# EAGLE design 304_usb_serial1010 (EAGLE 9.6.0)
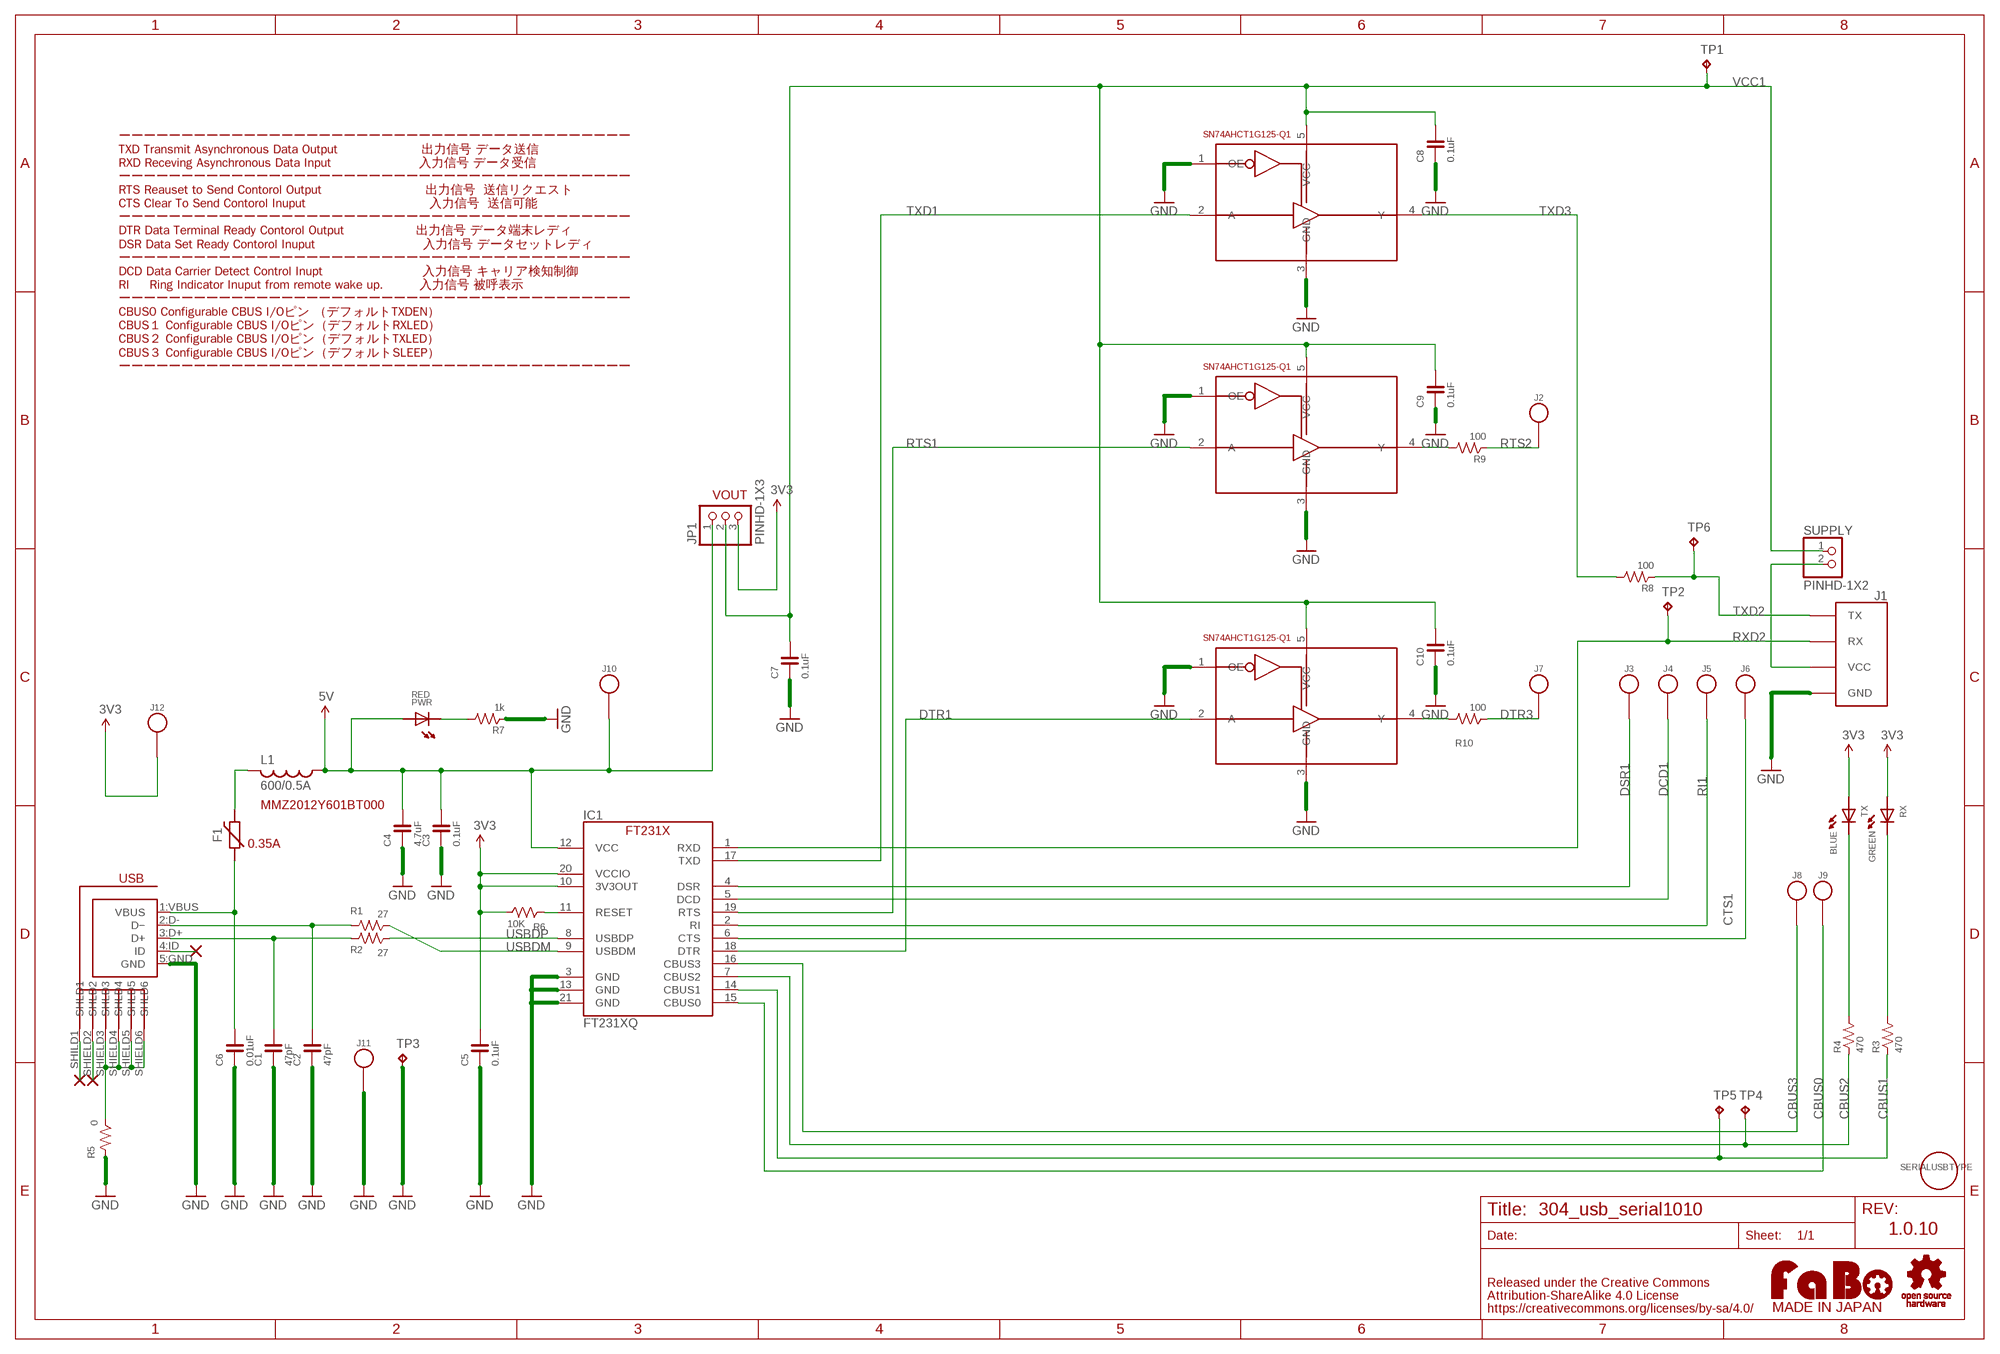
[diagram p0: schematic, sheet 1]

## Parts
C1  47pF  CAPACITOR-0603_NARROW  [0603-NARROW]
C2  47pF  CAPACITOR-0603_NARROW  [0603-NARROW]
C3  0.1uF  CAPACITOR-0603_NARROW  [0603-NARROW]
C4  4.7uF  CAPACITOR-0603_NARROW  [0603-NARROW]
C5  0.1uF  CAPACITOR-0603_NARROW  [0603-NARROW]
C6  0.01uF  CAPACITOR-0603_NARROW  [0603-NARROW]
C7  0.1uF  CAPACITOR-0603_NARROW  [0603-NARROW]
C8  0.1uF  CAPACITOR-0402-NO_SILK  [0402-NO_SILK]
C9  0.1uF  CAPACITOR-0402-NO_SILK  [0402-NO_SILK]
C10  0.1uF  CAPACITOR-0402-NO_SILK  [0402-NO_SILK]
F1  350mA  POLYSWITCH  [NANOSMDC035F]
IC1  FT231XQ  [QFN-20_FT231X]
J1  FABO_SERIAL_DIPINVERSE  [FABO_BRICK_SERIAL_B]
J2  PIN_HEADER_1X1_NOLABEL_C  [PIN_1X1_NOLABEL]
J3  PIN_HEADER_1X1_NOLABEL_C  [PIN_1X1_NOLABEL]
J4  PIN_HEADER_1X1_NOLABEL_C  [PIN_1X1_NOLABEL]
J5  PIN_HEADER_1X1_NOLABEL_C  [PIN_1X1_NOLABEL]
J6  PIN_HEADER_1X1_NOLABEL_C  [PIN_1X1_NOLABEL]
J7  PIN_HEADER_1X1_NOLABEL_C  [PIN_1X1_NOLABEL]
J8  PIN_HEADER_1X1_NOLABEL_C  [PIN_1X1_NOLABEL]
J9  PIN_HEADER_1X1_NOLABEL_C  [PIN_1X1_NOLABEL]
J10  PIN_HEADER_1X1_NOLABEL_C  [PIN_1X1_NOLABEL]
J11  PIN_HEADER_1X1_NOLABEL_C  [PIN_1X1_NOLABEL]
J12  PIN_HEADER_1X1_NOLABEL_C  [PIN_1X1_NOLABEL]
JP1  PINHD-1X3  [1X03]
L1  600/0.5A  INDUCTOR_0805_L  [RESC0805_L]
PWR  RED  LED-0603-NARROW  [0603-NARROW]
R1  27  RESISTOR-0603-NARROW  [0603-NARROW]
R2  27  RESISTOR-0603-NARROW  [0603-NARROW]
R3  470  RESISTOR-0603-NARROW  [0603-NARROW]
R4  470  RESISTOR-0603-NARROW  [0603-NARROW]
R5  0  RESISTOR-0603-NARROW  [0603-NARROW]
R6  10K  RESISTOR-0603-NARROW  [0603-NARROW]
R7  1k  RESISTOR-0603-NARROW  [0603-NARROW]
R8  100  RESISTOR-0603-NARROW  [0603-NARROW]
R9  100  RESISTOR-0603-NARROW  [0603-NARROW]
R10  100  RESISTOR-0603-NARROW  [0603-NARROW]
RX  GREEN  LED-0603-NARROW  [0603-NARROW]
SUPPLY  PINHD-1X2  [1X02]
TP1  TPB1,27  [B1,27]
TP2  TPTP20SQ  [TP20SQ]
TP3  TPTP20SQ  [TP20SQ]
TP4  TPB0,65  [B0,65]
TP5  TPB0,65  [B0,65]
TP6  TPTP20SQ  [TP20SQ]
TX  BLUE  LED-0603-NARROW  [0603-NARROW]
U$2  LOGO_FABO-M_BOTTOM  [LOGO_FABO_MS_BOTTOM]
U$3  LOGO_OSHW-M_BOTTOM  [LOGO_OSHW_M_BOTTOM]
U$4  ZX62D-B-5PA8(30)  [ZX62D-B-5PA8(30)]
U$5  FABO_BRICK_CONLESS_SERIALUSB  [FABO_BRICK_SERIAL_USB_WITHOUTCON]
U$6  SN74AHCT1G125-Q1  [SC70]
U$7  SN74AHCT1G125-Q1  [SC70]
U$8  SN74AHCT1G125-Q1  [SC70]

## Nets
3V3: C5.2 IC1.10(3V3OUT) IC1.20(VCCIO) J12.1 JP1.3 R6.1 RX.ANODE TX.ANODE
5V: C3.2 C4.2 IC1.12(VCC) J10.1 JP1.1 L1.1 PWR.ANODE
CBUS0: IC1.15(CBUS0) J9.1
CBUS1: IC1.14(CBUS1) R3.1 TP5.TP
CBUS2: IC1.7(CBUS2) R4.1 TP4.TP
CBUS3: IC1.16(CBUS3) J8.1
CTS1: IC1.6(CTS) J6.1
DCD1: IC1.5(DCD) J4.1
DSR1: IC1.4(DSR) J3.1
DTR1: IC1.18(DTR) U$8.2(A)
DTR3: J7.1 R10.1
GND: C1.1 C2.1 C3.1 C4.1 C5.1 C6.1 C7.1 C8.1 C9.1 C10.1 IC1.3(GND) IC1.13(GND) IC1.21(GND) J1.GND J11.1 R5.2 R7.1 TP3.TP U$4.5:GND(GND) U$6.1(OE) U$6.3(GND) U$7.1(OE) U$7.3(GND) U$8.1(OE) U$8.3(GND)
N$1: R9.2 U$7.4(Y)
N$2: F1.2 L1.2
N$3: C2.2 R1.2 U$4.2:D-(D−)
N$4: C1.2 R2.2 U$4.3:D+(D+)
N$5: PWR.CATHODE R7.2
N$6: R5.1 U$4.SHIELD3(SHLD3) U$4.SHIELD4(SHLD4) U$4.SHIELD5(SHLD5) U$4.SHIELD6(SHLD6)
N$8: R10.2 U$8.4(Y)
N$15: IC1.11(RESET) R6.2
N$22: U$4.4:ID(ID)
N$24: U$4.SHILD1(SHLD1)
N$28: U$4.SHIELD2(SHLD2)
N$33: R3.2 RX.CATHODE
N$35: R4.2 TX.CATHODE
RI1: IC1.2(RI) J5.1
RTS1: IC1.19(RTS) U$7.2(A)
RTS2: J2.1 R9.1
RXD2: IC1.1(RXD) J1.RX TP2.TP
TXD1: IC1.17(TXD) U$6.2(A)
TXD2: J1.TX R8.1 TP6.TP
TXD3: R8.2 U$6.4(Y)
USBDM: IC1.9(USBDM) R1.1
USBDP: IC1.8(USBDP) R2.1
VBUS: C6.2 F1.1 U$4.1:VBUS(VBUS)
VCC1: C7.2 C8.2 C9.2 C10.2 JP1.2 SUPPLY.1 TP1.TP U$6.5(VCC) U$7.5(VCC) U$8.5(VCC)
VCC2: J1.VCC SUPPLY.2

## Notes on the sheet
- ーーーーーーーーーーーーーーーーーーーーーーーーーーーーーーーーーーーーーーーーー
  TXD Transmit Asynchronous Data Output                     出力信号 データ送信
  RXD Receving Asynchronous Data Input                      入力信号 データ受信
  ーーーーーーーーーーーーーーーーーーーーーーーーーーーーーーーーーーーーーーーーー
  RTS Reauset to Send Contorol Output                          出力信号  送信リクエスト
  CTS Clear To Send Contorol Inuput                               入力信号  送信可能 
  ーーーーーーーーーーーーーーーーーーーーーーーーーーーーーーーーーーーーーーーーー
  DTR Data Terminal Ready Contorol Output                  出力信号 データ端末レディ
  DSR Data Set Ready Contorol Inuput                           入力信号 データセットレディ
  ーーーーーーーーーーーーーーーーーーーーーーーーーーーーーーーーーーーーーーーーー
  DCD Data Carrier Detect Control Inupt                         入力信号 キャリア検知制御
  RI     Ring Indicator Inuput from remote wake up.         入力信号 被呼表示
  ーーーーーーーーーーーーーーーーーーーーーーーーーーーーーーーーーーーーーーーーー
  CBUS0 Configurable CBUS I/Oピン （デフォルトTXDEN）
  CBUS１ Configurable CBUS I/Oピン（デフォルトRXLED）
  CBUS２ Configurable CBUS I/Oピン（デフォルトTXLED）
  CBUS３ Configurable CBUS I/Oピン（デフォルトSLEEP）
  ーーーーーーーーーーーーーーーーーーーーーーーーーーーーーーーーーーーーーーーーー
- VOUT
- MMZ2012Y601BT000
- 0.35A
- 1.0.10

## Library data of the parts
C1-C10 = FaBo-Capacitor:CAPACITOR: CAPACITOR
F1 = FaBo-Parts:POLYSWITCH
IC1 = FaBo-USB:FT231X
J1 = FaBo-Connetor:FABO_SERIAL_DIP: FaBo Brick Serial
J2-J12 = FaBo-PIN:PIN_HEADER_1X1_NOLABEL_C
JP1 = Connector:PINHD-1X3: PIN HEADER; CATEGORY: CONNECTOR; SUB-CATEGORY: PIN-HEADER
L1 = Nordic_nRF:INDUCTOR: Generic chip inductor
PWR RX TX = FaBo-LED:LED
R1-R10 = FaBo-Resistors:RESISTOR: RESISTOR
SUPPLY = Connector:PINHD-1X2: PIN HEADER; CATEGORY: CONNECTOR; SUB-CATEGORY: PIN-HEADER
TP1 = testpad:TP: Test pad
TP2-TP6 = BeagleBone_Blue_R3:TP: Test pad
U$2 = FaBo-Logo:LOGO_FABO
U$3 = FaBo-Logo:LOGO_OSHW
U$4 = FaBo-USB:ZX62D-B-5PA8(30)
U$5 = FaBo-Template:FABO_BRICK_CONLESS_SERIALUSB
U$6-U$8 = FaBo-LevelTranslator:SN74AHCT1G125-Q1: SN74AHCT1G125-Q1 SINGLE BUFFER GATE WITH 3 STATE OUTPUT

## Board
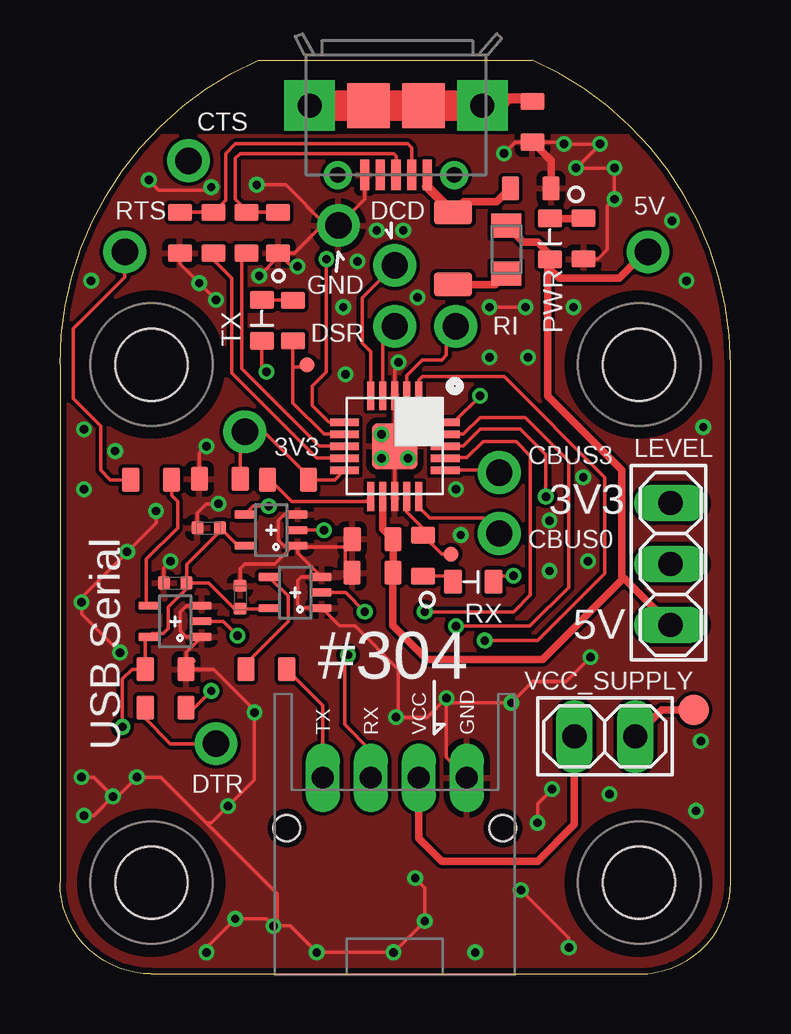
[diagram p1: board, top side]
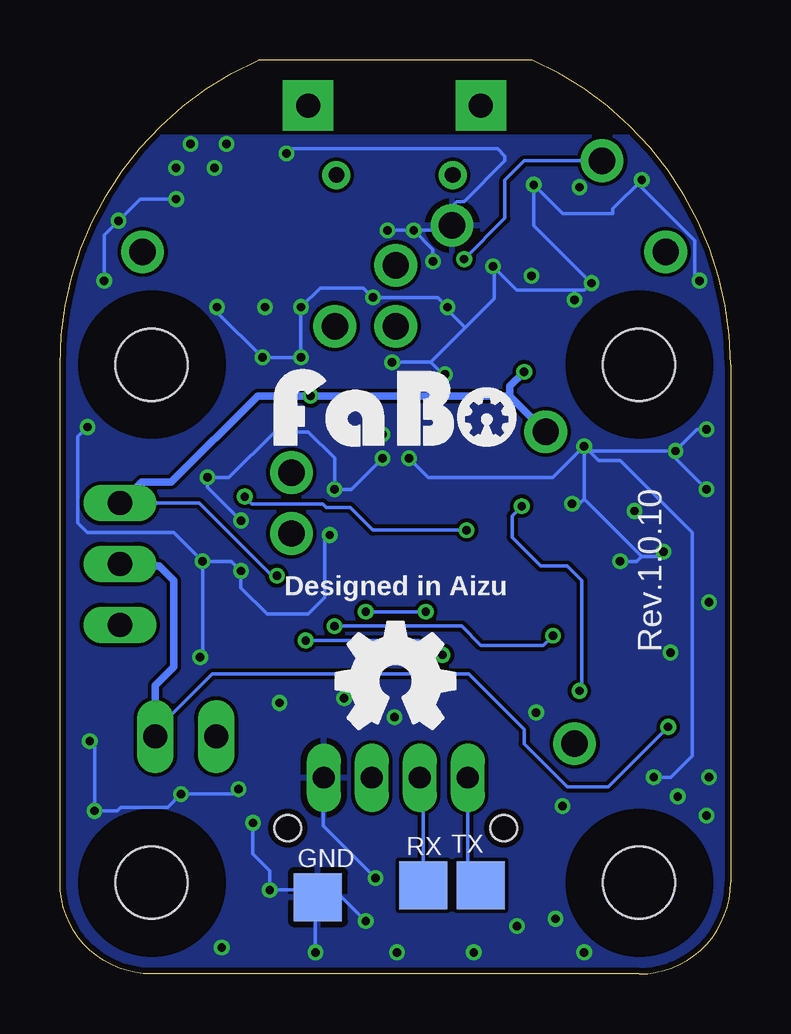
[diagram p2: board, bottom side, seen from below]

Size 27.94 x 38.1 mm. Coordinates in mm from the lower left corner, seen from the top.
Copper layers (1*16): Top 0.035mm / dielectric 1.5mm / Bottom 0.035mm
Design rules "Elecrow_angle": minimum track width 6mil, minimum drill 12mil, track to track 6mil, track to pad 6mil, pad to pad 6mil, via to via 6mil, smd to smd 0mil, copper to edge 10mil, drill to drill 10mil, minimum pad ring 10mil, minimum via ring 6mil, stop-mask expansion 2mil, vias tented up to drill 100mil, thermal gap 10mil
tRestrict: area 0.8,0.8 to 6.8,6.8; area 21.1,0.8 to 27.1,6.8; area 21.1,22.4 to 27.1,28.4; area 0.8,22.4 to 6.8,28.4
bRestrict: area 0.8,22.4 to 6.8,28.4; area 0.8,0.8 to 6.8,6.8; area 21.1,0.8 to 27.1,6.8; area 21.1,22.4 to 27.1,28.4

### Footprints (pad centres in the part's own frame; a part is rotated, then mirrored left to right if it is on the bottom)
0603-NARROW = smd 0.71 x 1: 1 -0.85,0; 2 0.85,0
0402-NO_SILK = smd 0.5 x 0.55: 1 -0.475,0; 2 0.475,0
NANOSMDC035F = smd 1 x 1.6: 1 -1.5,0; 2 1.5,0
QFN-20_FT231X = smd 1.2 x 0.3: 1 -2.1,1; 2 -2.1,0.5; 3 -2.1,0; 4 -2.1,-0.5; 5 -2.1,-1; 11 2.1,-1; 12 2.1,-0.5; 13 2.1,0; 14 2.1,0.5; 15 2.1,1 | smd 0.3 x 1.2: 6 -1,-2.1; 7 -0.5,-2.1; 8 0,-2.1; 9 0.5,-2.1; 10 1,-2.1; 16 1,2.1; 17 0.5,2.1; 18 0,2.1; 19 -0.5,2.1; 20 -1,2.1 | smd 1.9 x 1.9: 21 0,0
FABO_BRICK_SERIAL_B = drill 0.9 pad 1.422 long: GND 3,3.175; RX -1,3.175; TX -3,3.175; VCC 1,3.175 | hole 1.1: -4.5,1.075; 4.5,1.075
PIN_1X1_NOLABEL = drill 1.1 pad 1.778: 1 0,0
1X03 = drill 1.016 long: 1 -2.54,0; 2 0,0; 3 2.54,0
RESC0805_L = smd 1 x 1.25: 1 -1,0; 2 1,0
0603-NARROW' = smd 0.75 x 1: ANODE -0.85,0; CATHODE 0.85,0
1X02 = drill 1.016 long: 1 -1.27,0; 2 1.27,0
B1,27 = smd 1.27 x 1.27: TP 0,0
TP20SQ = smd 2 x 2: TP 0,0
B0,65 = smd 0.635 x 0.635: TP 0,0
ZX62D-B-5PA8(30) = smd 0.4 x 1.25: 1:VBUS -1.3,2.9; 2:D- -0.65,2.9; 3:D+ 0,2.9; 4:ID 0.65,2.9; 5:GND 1.3,2.9 | drill 0.65 pad 1.05: SHIELD2 2.425,2.9; SHILD1 -2.425,2.9 | drill 1 pad 2.1 square: SHIELD3 -3.6,0; SHIELD6 3.6,0 | smd 1.8 x 1.9: SHIELD4 -1.15,0; SHIELD5 1.15,0
FABO_BRICK_SERIAL_USB_WITHOUTCON = hole 3: -10.16,-15.24; 10.16,-15.24; 10.16,6.35; -10.16,6.35
SC70 = smd 0.35 x 0.85: 1 -0.65,-1.1; 2 0,-1.1; 3 0.65,-1.1; 4 0.65,1.1; 5 -0.65,1.1

### Placement (x,y rotation side)
C1  9.09,30.9 90 top
C2  5,30.9 90 top
C3  13.03,18.12 0 top
C4  13.02,16.73 0 top
C5  6.66,20.64 0 top
C6  19.61,32.75 180 top
C7  4.4,12.7 180 top
C8  4.8,16.3 0 top
C9  7.5,15.7 270 top
C10  6.2,18.6 0 top
F1  16.38,30.25 270 top
IC1  13.95,22 270 top
J1  13.95,5 0 top
J2  2.7,30.1 0 top
J3  13.95,27 0 top
J4  13.95,29.54 0 top
J5  16.49,27 0 top
J6  5.35,33.9 0 top
J7  6.5,9.6 0 top
J8  18.3,20.9 0 top
J9  18.3,18.36 0 top
J10  24.5,30.1 0 top
J11  11.6,31.2 0 top
J12  7.7,22.6 0 top
JP1  25.45,17.09 90 top
L1  18.6,30.2 270 top
PWR  RED  [0603-NARROW']  20.41,30.64 90 top
R1  6.4,30.9 90 top
R2  7.77,30.9 90 top
R3  15.12,17.43 270 top
R4  9.71,27.23 90 top
R5  19.68,35.52 270 top
R6  9.5,20.6 180 top
R7  21.82,30.66 90 top
R8  8.6,12.7 180 top
R9  3.8,20.6 0 top
R10  4.4,11.1 0 top
RX  GREEN  [0603-NARROW']  17.22,16.34 180 top
SUPPLY  22.7,9.9 180 top
TP1  26.4,11 0 top
TP2  12.8,3.7 0 bottom
TP3  17.2,3.2 0 bottom
TP4  10.3,25.4 0 top
TP5  16.3,17.5 0 top
TP6  10.4,3.7 0 bottom
TX  BLUE  [0603-NARROW']  8.41,27.25 90 top
U$2  13.97,21.6 0 top
U$3  13.95,12.21 0 top
U$4  14,36.2 180 top
U$5  13.97,19.05 0 top
U$6  9.8,15.9 90 top
U$7  4.8,14.7 90 top
U$8  8.8,18.5 90 top

### Tracks (layer width: path | path; a pad name or v marks a point on that pad's centre or on a via)
3V3  (via drill 0.35)
  Top 0.152: IC1.20 16.4,23 v17.5,24.1 | IC1.10 11.45,20.6 R6.1 10.35,20.75 8.5,22.6 J12.1 7.51,22.41 C5.2 | RX.ANODE 18.32,16.6 v18.9,16.6 | TX.ANODE 8.41,25.29 v8.6,25.1
  Bottom 0.152: v18.9,16.6 19.1,16.6 22.13,19.63 25.4,19.63 JP1.3
  Bottom 0.305: 25.4,19.63 24.53,20.5 23.3,20.5 19.7,24.1 v17.5,24.1 9.2,24.1 | 9.2,24.1 J12.1 | v8.6,25.1 9.2,24.5 9.2,24.1
5V
  Top 0.152: C3.2 13.85,18.15 13.68,18.32 | IC1.12 13.47,19.88 | C4.2 13.9,16.7
  Top 0.305: 23.5,16.5 23.4,16.59 23.4,21 20.32,24.09 20.32,29.48 20.41,29.39 | 23.5,16.5 JP1.1 | PWR.ANODE 20.11,29.8 | IC1.12 13.45,18.55 13.85,18.15 | C3.2 C4.2 13.9,16.7 | C4.2 13.87,14.53 15.28,13.12 20.12,13.12 23.5,16.5 | J10.1 24.5,30.2 23.3,29 20.8,29 20.41,29.39 | 20.41,29.39 PWR.ANODE | L1.1 19.3,30.5 19.9,30.5 20.41,29.98 PWR.ANODE
CBUS0
  Top 0.152: IC1.15 15,19.85 15,19.4 15.4,19 17.66,19 J9.1
CBUS1
  Top 0.152: IC1.14 14.45,19.25 15.12,18.58 R3.1 15.9,17.5 TP5.TP
CBUS2
  Top 0.152: 9.71,26.59 R4.1 9.7,25.3 | IC1.7 11,22.5 9.7,23.8 9.7,25.3 | TP4.TP 10.2,25.3 9.7,25.3
CBUS3
  Top 0.152: IC1.16 18.2,21 J8.1
CTS1  (via drill 0.35)
  Top 0.152: v11.1,29.8 11.1,25.1 10.5,24.5 10.5,23.7 11.2,23 IC1.6
  Bottom 0.152: v11.1,29.8 9.4,31.5 9.4,33.1 8.6,33.9 J6.1
DCD1
  Top 0.152: IC1.5 12.95,25.95 12.6,26.3 12.6,28.2 J4.1
DSR1
  Top 0.152: IC1.4 13.45,26.5 J3.1
DTR1  (via drill 0.35)
  Top 0.152: IC1.18 16.8,22 17.52,22.72 19.18,22.72 20.24,21.66 v20.24,19.9 | U$8.2 v11,18.5
  Bottom 0.152: v20.24,19.9 19.94,19.6 17,19.6 16.85,19.45 15.85,19.45 14.9,18.5 v11,18.5
DTR3
  Top 0.152: R10.1 3.55,10.65 4.6,9.6 J7.1
GND  (via drill 0.35)
  Top 0.152: v18.5,34.2 18.98,34.67 R5.2 19.7,34.67 20.93,34.67 v21,34.6 v22.5,34.6 v21.5,33.6 v23.1,33.6 v23.1,32.3 22.8,32 22.8,30.2 22.4,29.8 22.39,29.8 R7.1 | 4.84,29.75 4.7,29.75 C2.1 5,29.61 v5.8,28.8 v6.5,28.1 | IC1.13 IC1.21 | 11.88,17.8 11.88,18.2 12.18,17.9 C3.1 11.85,17.8 9.9,17.8 | 11.88,17.8 11.88,17.02 C4.1 | C7.1 5,12.95 | 5.6,13.05 C7.1 | 11.89,17 C4.1 | 12.7,32.8 U$4.5:GND 12.7,32.3 J11.1 11.1,31.2 | v8.2,32.9 9.4,32.9 11.1,31.2 | 9.12,30.02 C1.1 9.75,30.05 10.9,31.2 11.1,31.2 | 9.12,30.02 9.64,29.5 v9.9,29.5 | v14.1,25.5 13.95,25.35 IC1.3 IC1.21 | IC1.21 14.45,22.5 v14.5,22.5 | IC1.21 14,22 v14.5,21.5 | IC1.21 13.45,21.5 v13.4,21.5 | v6.1,22 5.81,21.71 C5.1 | 6.1,6.3 9.05,3.35 9.05,2.25 8.85,2.05 | 6.1,6.3 4.2,8.2 v3.2,8.2 2.4,7.4 v2.2,7.4 | IC1.21 13.45,22.5 v13.4,22.5 | 14.6,4 v14.8,4 | v17.9,27.8 v19.4,27.8 | v22.1,13.2 21.1,12.2 19.7,12.2 v18.8,11.3 16.3,11.3 v16.1,11.5 | v16.1,11.5 15.3,10.7 14.1,10.7 | 14.1,10.7 v14,10.7 | J1.GND 16.1,9.03 v16.1,11.5 | v0.9,8.2 1.4,8.2 v2.2,7.4 | v1,6.6 1.4,6.6 v2.2,7.4 | 6.1,6.3 6.3,6.3 v7,7 8.1,8.1 v8.1,10.9 8.1,11 6.4,12.7 C7.1 | v6.1,0.9 6.1,1.1 v7.3,2.3 8.6,2.3 8.85,2.05 | 8.85,2.05 v8.9,2 9.6,2 v10.7,0.9 v13.9,0.9 v15.2,2.2 15.2,3.6 v14.8,4 | 14.7,4.1 v14.8,4 | v19.9,6.3 19.9,7.1 v20.5,7.7 | v19.2,3.5 21.2,1.5 v21.2,1.1 | v6.3,32.8 6.18,32.68 4.12,32.68 v3.7,33.1 | v8.3,29.1 9.12,29.92 9.12,30.02 | 11.99,16.9 C4.1 | 11.7,17.8 11.88,17.8 | 9.7,17.85 U$8.1 9.9,17.8 | 9.7,17.85 9.35,17.85 9.1,18.1 9.1,18.9 9.35,19.15 U$8.3 | U$7.3 5.25,15.35 5,15.1 5,14.3 5.25,14.05 U$7.1 5.25,13.4 C7.1 | C10.1 5.72,19.23 6.1,19.6 v6.6,19.6 | C8.1 4.33,16.93 v4.6,17.2 | 9.9,17.8 9.9,17.55 U$6.3 10.05,16.55 9.9,16.4 9.9,15.4 10.05,15.25 U$6.1 11.65,14.5 12.3,14.5 14.1,12.7 14.1,10.7
  Top 0.152: v2.5,13.4 0.9,15 v0.9,15.5 0.9,15.7 v2.8,17.6 4,18.8 v4,19.3 | C9.1 7.5,16.9 7.7,17.1 8.95,17.1 9.7,17.85
  Top 0.305: C6.1 20.46,33.91 19.7,34.67
  Bottom 0.152: v18.5,34.2 18.3,34.4 9.7,34.4 9.4,34.1 9.4,33.9 11.1,32.2 11.4,32.2 11.6,32 J11.1 11.8,31 v13.2,31 | v9.9,29.5 9.85,29.45 | 9.85,29.45 8.9,28.5 6.1,28.5 v5.8,28.8 8.2,31.2 v8.2,32.9 7,31.7 4.9,31.7 4.9,31.9 v3.7,33.1 3.7,32.78 1.48,30.56 1.48,29.08 v1.3,28.9 | v14.1,25.5 12.5,25.5 | 9.85,29.45 9.85,28.15 11.05,26.95 | 12.5,25.5 11.05,26.95 | 6.1,19.8 3.7,17.4 | v6.1,22 6.1,19.8 | v14.8,4 16.97,6.17 16.97,8.15 J1.GND | v13.4,21.5 12.6,20.7 7.4,20.7 v6.1,22 | v6.1,22 5.5,21.4 4.6,21.4 1.6,18.4 1.6,9.1 2.5,8.2 v3.2,8.2 | v1,22.7 1.4,22.7 v2.3,21.8 | v2.3,21.8 2.3,21.5 v1,20.2 | v2.3,21.8 5.9,21.8 v6.1,22 | v11.9,25 12,25 12.5,25.5 | 11.05,26.95 11.8,27.7 v11.8,27.8 12.2,28.2 v14.9,28.2 15.3,28.6 17.1,28.6 v17.9,27.8 v17.9,25.7 v19.5,25.7 21.4,27.6 v21.4,27.8 | v23.1,32.3 24.6,32.3 v25.5,31.4 26.1,30.8 v26.1,28.9 | v14.5,21.5 15.8,20.2 v16.5,20.2 16.5,21.5 17.6,22.6 19,22.6 20.9,20.7 v21.8,20.7 21.8,20.3 v20.4,18.9 | v16.7,18.3 16.9,18.1 16.9,15.7 17.6,15 19.3,15 20.4,16.1 v20.4,16.8 20.8,17.2 v22,17.2 | v20.5,7.7 20.7,7.5 v22.9,7.5 23.45,6.95 25.41,6.95 25.56,6.8 v26.5,6.8 26.5,9.5 v26.7,9.7 | v19.9,6.3 19.9,5 19.2,4.3 v19.2,3.5 17.5,3.5 17.3,3.3 | v22,17.2 22,13.3 v22.1,13.2 | v12.4,29.7 12.4,30.2 v13.2,31 | v13.2,31 v14.3,31 | v22,17.2 23.2,18.4 26.8,18.4 27.2,18.8 27.2,22.4 v26.8,22.8 | v15.2,2.2 16.2,3.2 TP3.TP 17.3,3.3 | v17.3,0.9 17.3,3.3 | 6.1,19.8 6.3,19.6 v6.6,19.6 | v4.6,17.2 3.9,17.2 3.7,17.4 | 3.7,17.4 3,17.4 v2.8,17.6
  pour Bottom: 0.1,0 27.74,0 27.74,34.9 0.1,34.9
  pour Top: 0.1,0 27.74,0 27.74,34.9 0.1,34.9
N$1
  Top 0.152: R9.2 4.65,19.95 4.9,19.7 4.9,18.6 3.6,17.3 3.6,15.45 U$7.4
N$2
  Top 0.305: 16.68,29.05 F1.2 18.14,28.75 L1.2
N$3
  Top 0.152: U$4.2:D- 14.65,34.45 14.49,34.6 7.3,34.6 6.9,34.2 6.9,32.25 R1.2 C2.2
N$4
  Top 0.152: U$4.3:D+ 14,34.1 13.9,34.2 7.5,34.2 7.3,34 7.3,32.3 7.77,31.83 R2.2 C1.2
N$5
  Top 0.305: R7.2 21.8,31.5 PWR.CATHODE
N$6
  Top 0.406: U$4.SHIELD3 18.4,36.2 18.7,36.5 19.56,36.5 R5.1
  Top 1.27: U$4.SHIELD6 U$4.SHIELD5 U$4.SHIELD4 U$4.SHIELD3
N$8  (via drill 0.35)
  Top 0.152: 8.05,19.15 U$8.4 8.05,19.5 v8.7,19.5 | v6.3,11.8 5.6,11.1 R10.2
  Bottom 0.152: v6.3,11.8 6.2,11.9 6.2,16.4 6.8,17 7.9,17 9.1,18.2 9.1,19.1 v8.7,19.5
N$15
  Top 0.152: 8.6,20.55 R6.2 8.75,20.6 9.65,19.7 12.75,19.7 IC1.11
N$33
  Top 0.152: RX.CATHODE 16.13,16.59 R3.2
N$35
  Top 0.152: 8.43,28.09 TX.CATHODE R4.2
RI1
  Top 0.152: IC1.2 14.45,24.95 15.1,25.6 15.9,25.6 16.1,25.8 16.1,26.7 16.19,26.7 J5.1
RTS1  (via drill 0.35)
  Top 0.152: IC1.19 16.8,22.5 17.5,23.2 19.38,23.2 21.2,21.38 21.2,16.12 19.58,14.5 v16.5,14.5 | v7.4,14.1 6.8,14.7 U$7.2
  Bottom 0.152: v16.5,14.5 11.2,14.5 10.4,13.7 7.8,13.7 v7.4,14.1
RTS2
  Top 0.152: J2.1 2.7,29.06 0.55,26.91 0.55,23.99 1.7,22.84 1.7,21 2.1,20.6 R9.1
RXD2  (via drill 0.35)
  Top 0.152: IC1.1 14.95,24.75 15.1,24.9 18.5,24.9 22.7,20.7 22.7,16.7 19.9,13.9 v17.7,13.9 | v12,13.3 11.86,13.15 11.86,10.4 12.95,9.3 J1.RX
  Bottom 0.152: v17.7,13.9 13,13.9 12.4,13.3 v12,13.3 | TP2.TP 12.8,8.03 J1.RX
TXD1  (via drill 0.35)
  Top 0.152: IC1.17 16.07,21.52 16.95,21.52 17.63,22.2 19,22.2 19.6,21.6 19.6,15.8 18.9,15.1 v15.2,15.1 | v12.7,15.1 11.9,15.9 U$6.2
  Bottom 0.152: v15.2,15.1 v12.7,15.1
TXD2
  Top 0.152: R8.1 10.95,11.2 J1.TX
  Bottom 0.152: TP6.TP 10.95,4.25 J1.TX
TXD3
  Top 0.152: 7.8,12.75 R8.2 7.75,12.95 9.5,14.7 9.5,15.75 U$6.4
USBDM
  Top 0.152: 6.4,30.16 R1.1 6.4,29.75 7.15,29 7.15,25.05 10.7,21.5 IC1.9
USBDP
  Top 0.152: R2.1 7.57,29.85 7.57,25.23 10.8,22 IC1.8
VBUS
  Top 0.305: F1.1 16.83,32.2 18.2,32.2 C6.2
  Top 0.406: U$4.1:VBUS 15.3,32.82 F1.1
VCC1  (via drill 0.35)
  Top 0.152: TP1.TP 26.2,11.2 | C7.2 3.55,13.05 | U$8.5 7.42,17.85 C10.2 6.67,18.48 5.28,17.07 C8.2 5.3,16.3 | U$6.5 8.68,15.22 C9.2 7.28,15.22 6.2,16.3 5.3,16.3 | 5.3,16.3 5.3,16.1 4.5,15.3 4.5,14.4 4.3,14.2 3.85,14.2 U$7.5 3.55,13.9 C7.2 | v2.6,10.3 2.6,12.3 3,12.7 C7.2
  Top 0.305: SUPPLY.1 25.07,11 TP1.TP
  Bottom 0.152: SUPPLY.1 23.97,10 23.97,10.13 21.6,12.5 10.9,12.5 8.6,10.2 8.6,9.6 6.8,7.8 5.1,7.8 v2.6,10.3
  Bottom 0.305: JP1.2 25.36,17 23.8,17 23.2,16.4 23.2,12.8 23.97,12.03 23.97,10
VCC2
  Top 0.305: J1.VCC 14.95,5.65 15.9,4.7 19.9,4.7 21.43,6.23 SUPPLY.2

### Text on the board
tPlace: CTS | 5V | RTS | DCD | GND | RI | DSR | 3V3 | LEVEL | CBUS3 | 3V3 | CBUS0 | 5V | #304 | VCC_SUPPLY | USB Serial | DTR
bPlace: Rev.1.0.10 | Designed in Aizu | TX | RX | GND